# EAGLE design escv1 (EAGLE 9.6.1)
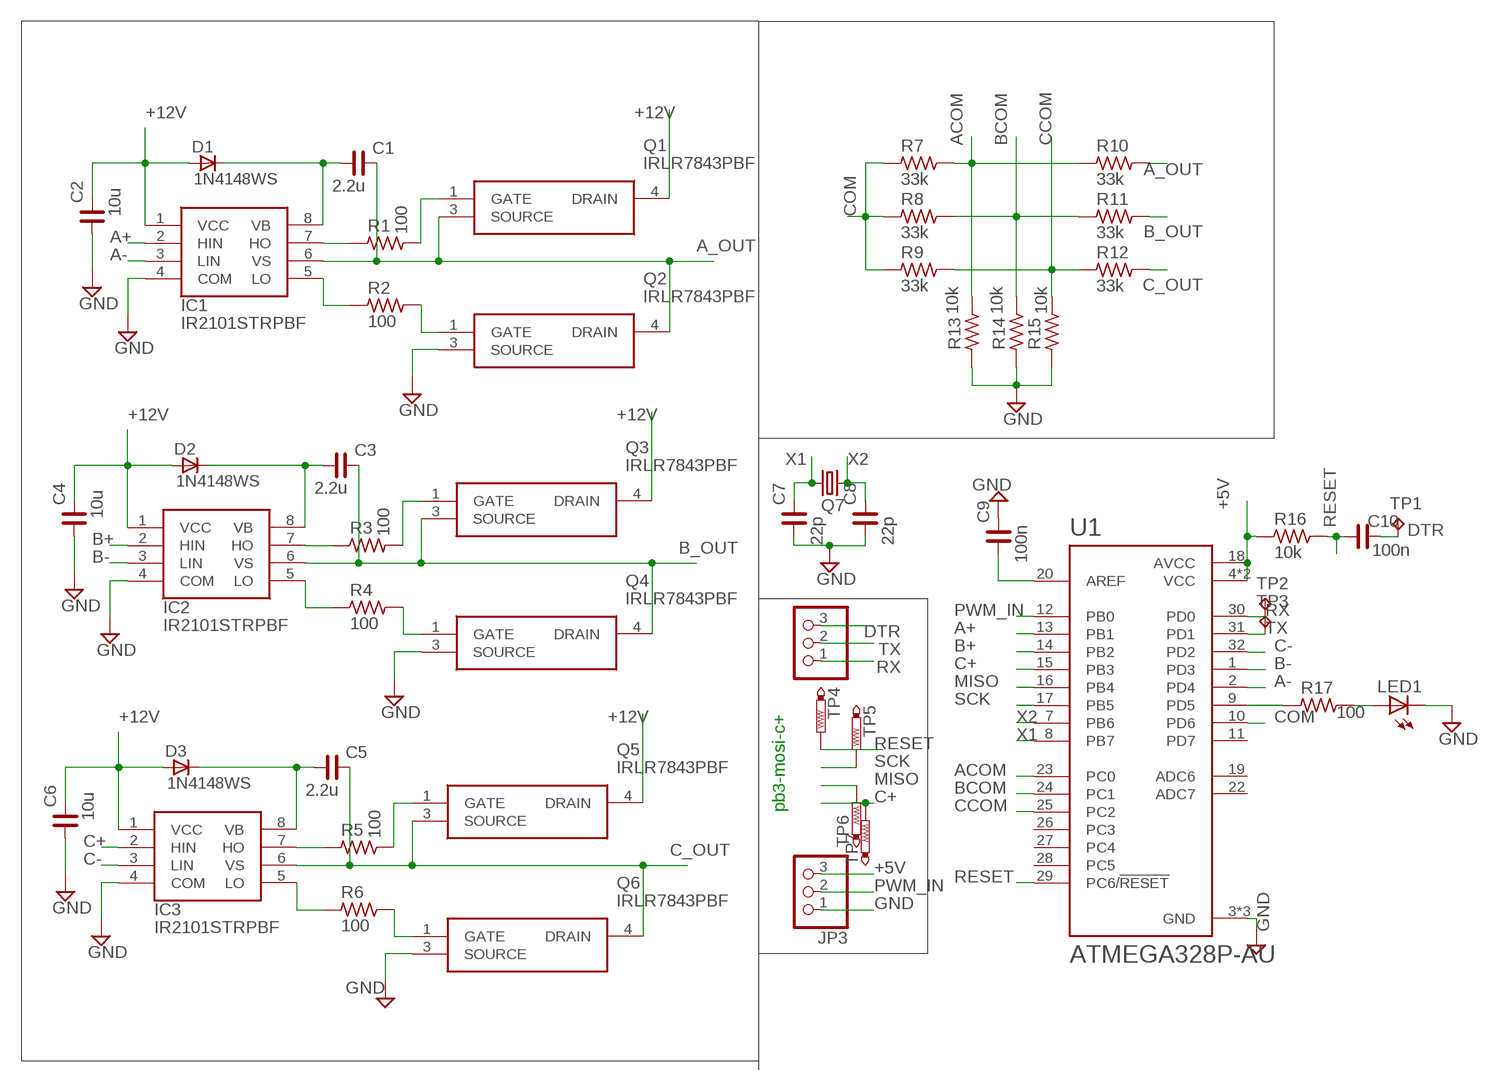
[diagram p0: schematic, sheet 1]

## Parts
C1  2.2u  C_2012  [C2012]
C2  10u  C_2012  [C2012]
C3  2.2u  C_2012  [C2012]
C4  10u  C_2012  [C2012]
C5  2.2u  C_2012  [C2012]
C6  10u  C_2012  [C2012]
C7  22p  C_2012  [C2012]
C8  22p  C_2012  [C2012]
C9  100n  C_2012  [C2012]
C10  100n  C_2012  [C2012]
D1  1N4148WS  [SOD323F]
D2  1N4148WS  [SOD323F]
D3  1N4148WS  [SOD323F]
IC1  IR2101STRPBF  [SOIC127P600X175-8N]
IC2  IR2101STRPBF  [SOIC127P600X175-8N]
IC3  IR2101STRPBF  [SOIC127P600X175-8N]
JP1  PINHD-1X3  [1X03]
JP3  PINHD-1X3  [1X03]
LED1  LEDCHIP-LED0805  [CHIP-LED0805]
Q1  IRLR7843PBF  [D-PAK(TO-252AA)_1]
Q2  IRLR7843PBF  [D-PAK(TO-252AA)_1]
Q3  IRLR7843PBF  [D-PAK(TO-252AA)_1]
Q4  IRLR7843PBF  [D-PAK(TO-252AA)_1]
Q5  IRLR7843PBF  [D-PAK(TO-252AA)_1]
Q6  IRLR7843PBF  [D-PAK(TO-252AA)_1]
Q7  CRYSTALSM49  [SM49]
R1  100  R_2012  [R2012]
R2  100  R_2012  [R2012]
R3  100  R_2012  [R2012]
R4  100  R_2012  [R2012]
R5  100  R_2012  [R2012]
R6  100  R_2012  [R2012]
R7  33k  R_2012  [R2012]
R8  33k  R_2012  [R2012]
R9  33k  R_2012  [R2012]
R10  33k  R_2012  [R2012]
R11  33k  R_2012  [R2012]
R12  33k  R_2012  [R2012]
R13  10k  R_2012  [R2012]
R14  10k  R_2012  [R2012]
R15  10k  R_2012  [R2012]
R16  10k  R_2012  [R2012]
R17  100  R_2012  [R2012]
TP1  TPTP07R  [TP07R]
TP2  TPTP07R  [TP07R]
TP3  TPTP07R  [TP07R]
TP4  PTR1TP10R  [TP10R]
TP5  PTR1TP10R  [TP10R]
TP6  PTR1TP10R  [TP10R]
TP7  PTR1TP10R  [TP10R]
U1  ATMEGA328P-AU  [QFP80P900X900X120-32N]

## Nets
+5V: JP3.3 R16.1 U1.4(VCC) U1.6(VCC) U1.18(AVCC)
+12V: C2.2 C4.2 C6.2 D1.A D2.A D3.A IC1.1(VCC) IC2.1(VCC) IC3.1(VCC) Q1.4(DRAIN) Q3.4(DRAIN) Q5.4(DRAIN)
A+: IC1.2(HIN) U1.13(PB1)
A-: IC1.3(LIN) U1.2(PD4)
A_OUT: C1.2 IC1.6(VS) Q1.3(SOURCE) Q2.4(DRAIN) R10.2
ACOM: R7.2 R10.1 R13.2 U1.23(PC0)
B+: IC2.2(HIN) U1.14(PB2)
B-: IC2.3(LIN) U1.1(PD3)
B_OUT: C3.2 IC2.6(VS) Q3.3(SOURCE) Q4.4(DRAIN) R11.2
BCOM: R8.2 R11.1 R14.2 U1.24(PC1)
C+: IC3.2(HIN) TP7.TP U1.15(PB3)
C-: IC3.3(LIN) U1.32(PD2)
C_OUT: C5.2 IC3.6(VS) Q5.3(SOURCE) Q6.4(DRAIN) R12.2
CCOM: R9.2 R12.1 R15.2 U1.25(PC2)
COM: R7.1 R8.1 R9.1 U1.10(PD6)
DTR: C10.2 JP1.3 TP1.TP
GND: C2.1 C4.1 C6.1 C7.1 C8.1 C9.2 IC1.4(COM) IC2.4(COM) IC3.4(COM) JP3.1 LED1.C Q2.3(SOURCE) Q4.3(SOURCE) Q6.3(SOURCE) R13.1 R14.1 R15.1 U1.3(GND) U1.5(GND) U1.21(GND)
MISO: TP6.TP U1.16(PB4)
N$1: C3.1 D2.C IC2.8(VB)
N$2: C1.1 D1.C IC1.8(VB)
N$3: IC1.7(HO) R1.1
N$4: IC1.5(LO) R2.1
N$5: Q1.1(GATE) R1.2
N$6: Q2.1(GATE) R2.2
N$7: IC2.7(HO) R3.1
N$8: IC2.5(LO) R4.1
N$9: Q3.1(GATE) R3.2
N$10: Q4.1(GATE) R4.2
N$11: C5.1 D3.C IC3.8(VB)
N$12: IC3.7(HO) R5.1
N$13: IC3.5(LO) R6.1
N$14: Q5.1(GATE) R5.2
N$15: Q6.1(GATE) R6.2
N$16: C9.1 U1.20(AREF)
N$17: R17.1 U1.9(PD5)
N$18: LED1.A R17.2
PWM_IN: JP3.2 U1.12(PB0)
RESET: C10.1 R16.2 TP4.TP U1.29(PC6/!RESET)
RX: JP1.1 TP2.TP U1.30(PD0)
SCK: TP5.TP U1.17(PB5)
TX: JP1.2 TP3.TP U1.31(PD1)
X1: C7.2 Q7.1 U1.8(PB7)
X2: C8.2 Q7.2 U1.7(PB6)
Unconnected: U1.11(PD7) U1.19(ADC6) U1.22(ADC7) U1.26(PC3) U1.27(PC4) U1.28(PC5)

## Notes on the sheet
- pb3-mosi-c+

## Library data of the parts
C1-C10 = rc-master-smd:C_: NON-POLARIZED CAP
D1-D3 = _hhn_diodes_smd:1N4148WS: 1N4148 General Purpose Rectifie SMD-Version of 1N4148 Case: SOD 323 F Author: Dipl.-Ing. FH Rainer Bayer HHN Hochschule Heilbronn, rainer.bayer@hs-heilbronn.de Ingenieurbüro ing-rb, mail@ing-rb.de
IC1-IC3 = IR2101STRPBF:IR2101STRPBF: High and Low Side Driver SOIC8 Infineon IR2101STRPBF, Dual MOSFET Power Driver, 360mA, 10 20 V, Non-Inverting, 8-Pin SOIC Source: Datasheet <http://uk.rs-online.com/web/p/products/1248778>; ARROW_PART_NUMBER: IR2101STRPBF; ARROW_PRICE-STOCK: https://www.arrow.com/en/products/ir2101strpbf/infineon-technologies-ag; DESCRIPTION: High and Low Side Driver SOIC8 Infineon IR2101STRPBF, Dual MOSFET Power Driver, 360mA, 10 20 V, Non-Inverting, 8-Pin SOIC; HEIGHT: 1.75mm; MANUFACTURER_NAME: Infineon; MANUFACTURER_PART_NUMBER: IR2101STRPBF; MOUSER_PART_NUMBER: 942-IR2101STRPBF; MOUSER_PRICE-STOCK: https://www.mouser.co.uk/ProductDetail/Infineon-Technologies/IR2101STRPBF?qs=ellYJlE8XiER7yumWzaY8w%3D%3D
JP1 JP3 = pinhead:PINHD-1X3: PIN HEADER
LED1 = adafruit:LED: LED OSRAM: - CHIPLED LG R971, LG N971, LY N971, LG Q971, LY Q971, LO R971, LY R971 LH N974, LH R974 LS Q976, LO Q976, LY Q976 LO Q996 - Hyper CHIPLED LW Q18S LB Q993, LB Q99A, LB R99A - SideLED LS A670, LO A670, LY A670, LG A670, LP A670 LB A673, LV A673, LT A673, LW A673 LH A674 LY A675 LS A676, LA A676, LO A676, LY A676, LW A676 LS A679, LY A679, LG A679 - Hyper Micro SIDELED® LS Y876, LA Y876, LO Y876, LY Y876 LT Y87S - SmartLED LW L88C, LW L88S LB L89C, LB L89S, LG L890 LS L89K, LO L89K, LY L89K LS L896, LA L896, LO L896, LY L896 - TOPLED LS T670, LO T670, LY T670, LG T670, LP T670 LSG T670, LSP T670, LSY T670, LOP T670, LYG T670 LG T671, LOG T671, LSG T671 LB T673, LV T673, LT T673, LW T673 LH T674 LS T676, LA T676, LO T676, LY T676, LB T676, LH T676, LSB T676, LW T676 LB T67C, LV T67C, LT T67C, LS T67K, LO T67K, LY T67K, LW E67C LS E67B, LA E67B, LO E67B, LY E67B, LB E67C, LV E67C, LT E67C LW T67C LS T679, LY T679, LG T679 LS T770, LO T770, LY T770, LG T770, LP T770 LB T773, LV T773, LT T773, LW T773 LH T774 LS E675, LA E675, LY E675, LS T675 LS T776, LA T776, LO T776, LY T776, LB T776 LHGB T686 LT T68C, LB T68C - Hyper Mini TOPLED® LB M676 - Mini TOPLED Santana® LG M470 LS M47K, LO M47K, LY M47K Source: http://www.osram.convergy.de/
Q1-Q6 = IRLR7843PBFtrans:IRLR7843PBF: HEXFET N-Ch MOSFET 161A 30V DPAK Infineon IRLR7843PBF N-channel MOSFET Transistor, 161 A, 30 V, 3-Pin DPAK Source: Datasheet <https://www.infineon.com/dgdl/irlr7843pbf.pdf?fileId=5546d462533600a40153566de53526d8>; ARROW_PART_NUMBER: IRLR7843PBF; ARROW_PRICE-STOCK: https://www.arrow.com/en/products/irlr7843pbf/infineon-technologies-ag; DESCRIPTION: HEXFET N-Ch MOSFET 161A 30V DPAK Infineon IRLR7843PBF N-channel MOSFET Transistor, 161 A, 30 V, 3-Pin DPAK; HEIGHT: mm; MANUFACTURER_NAME: Infineon; MANUFACTURER_PART_NUMBER: IRLR7843PBF; MOUSER_PART_NUMBER: 942-IRLR7843PBF; MOUSER_PRICE-STOCK: https://www.mouser.com/Search/Refine.aspx?Keyword=942-IRLR7843PBF
Q7 = crystal:CRYSTAL: CRYSTAL; OC_FARNELL: unknown; OC_NEWARK: unknown
R1-R17 = rc-master-smd:R_: RESISTOR
TP1-TP3 = testpad:TP: Test pad
TP4-TP7 = testpad:PTR1: TEST PIN
U1 = ATMEGA328P-AU:ATMEGA328P-AU: ATmega Series 20 MHz 32 KB Flash 2 KB SRAM 8-Bit Microcontroller - TQFP-32; AVAILABILITY: Unavailable; DESCRIPTION: AVR AVR® ATmega Microcontroller IC 8-Bit 20MHz 32KB (16K x 16) FLASH 32-TQFP (7x7); DIGIKEY-PURCHASE-URL: https://snapeda.com/shop?store=DigiKey&id=4703996; MF: Microchip Technology; MP: ATMEGA328P-AU; PACKAGE: TQFP-32 Microchip Technology; PRICE: None

## Board
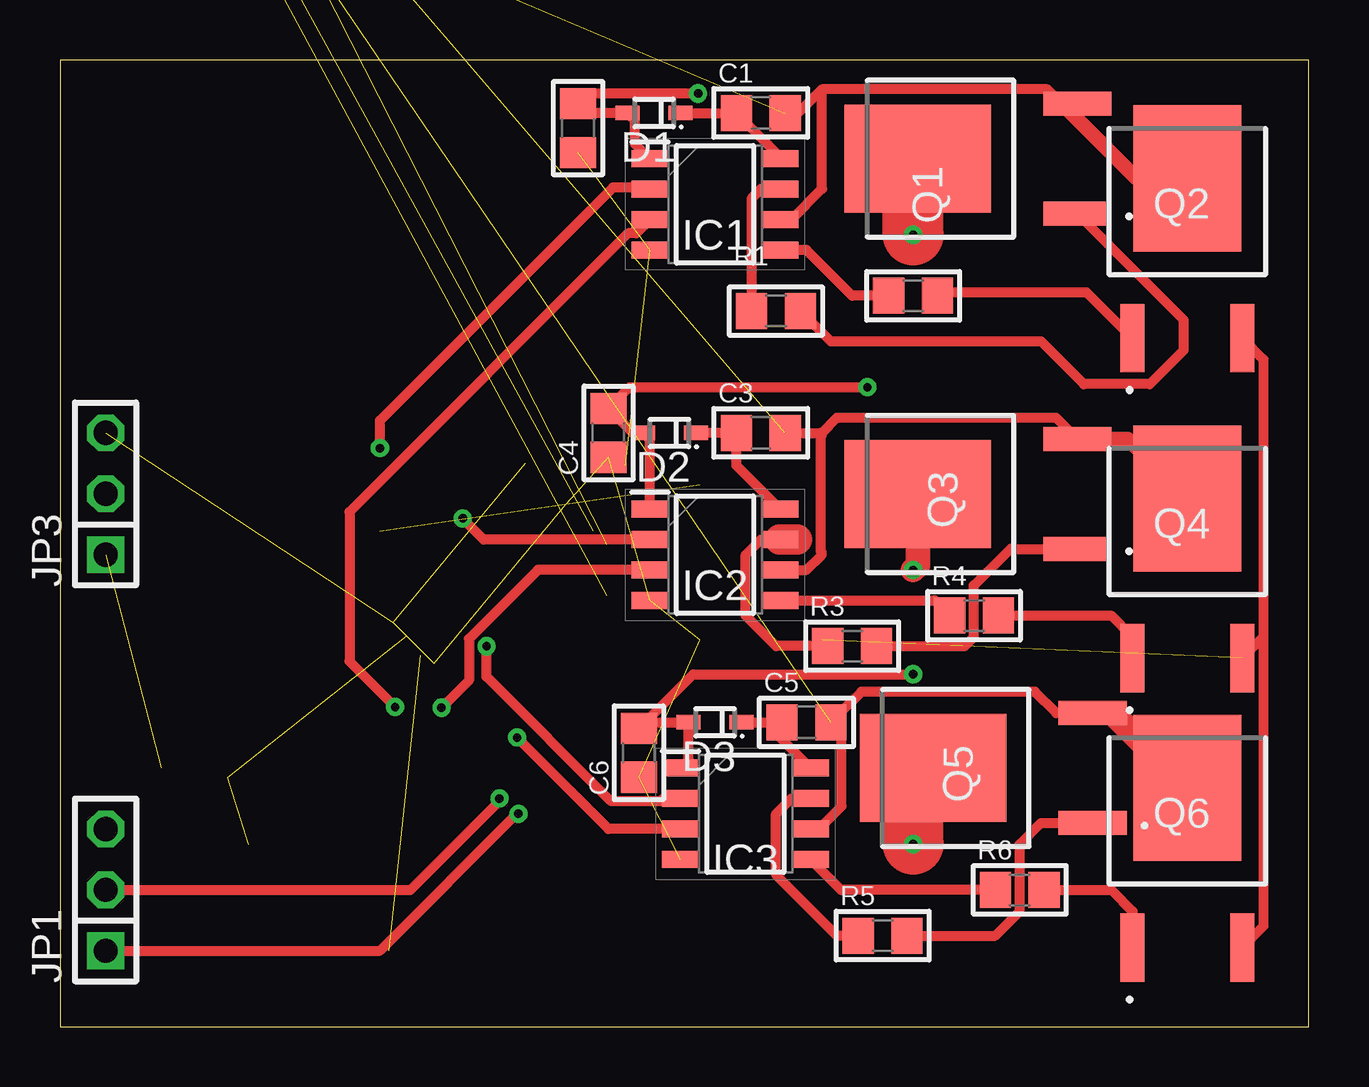
[diagram p1: board, top side]
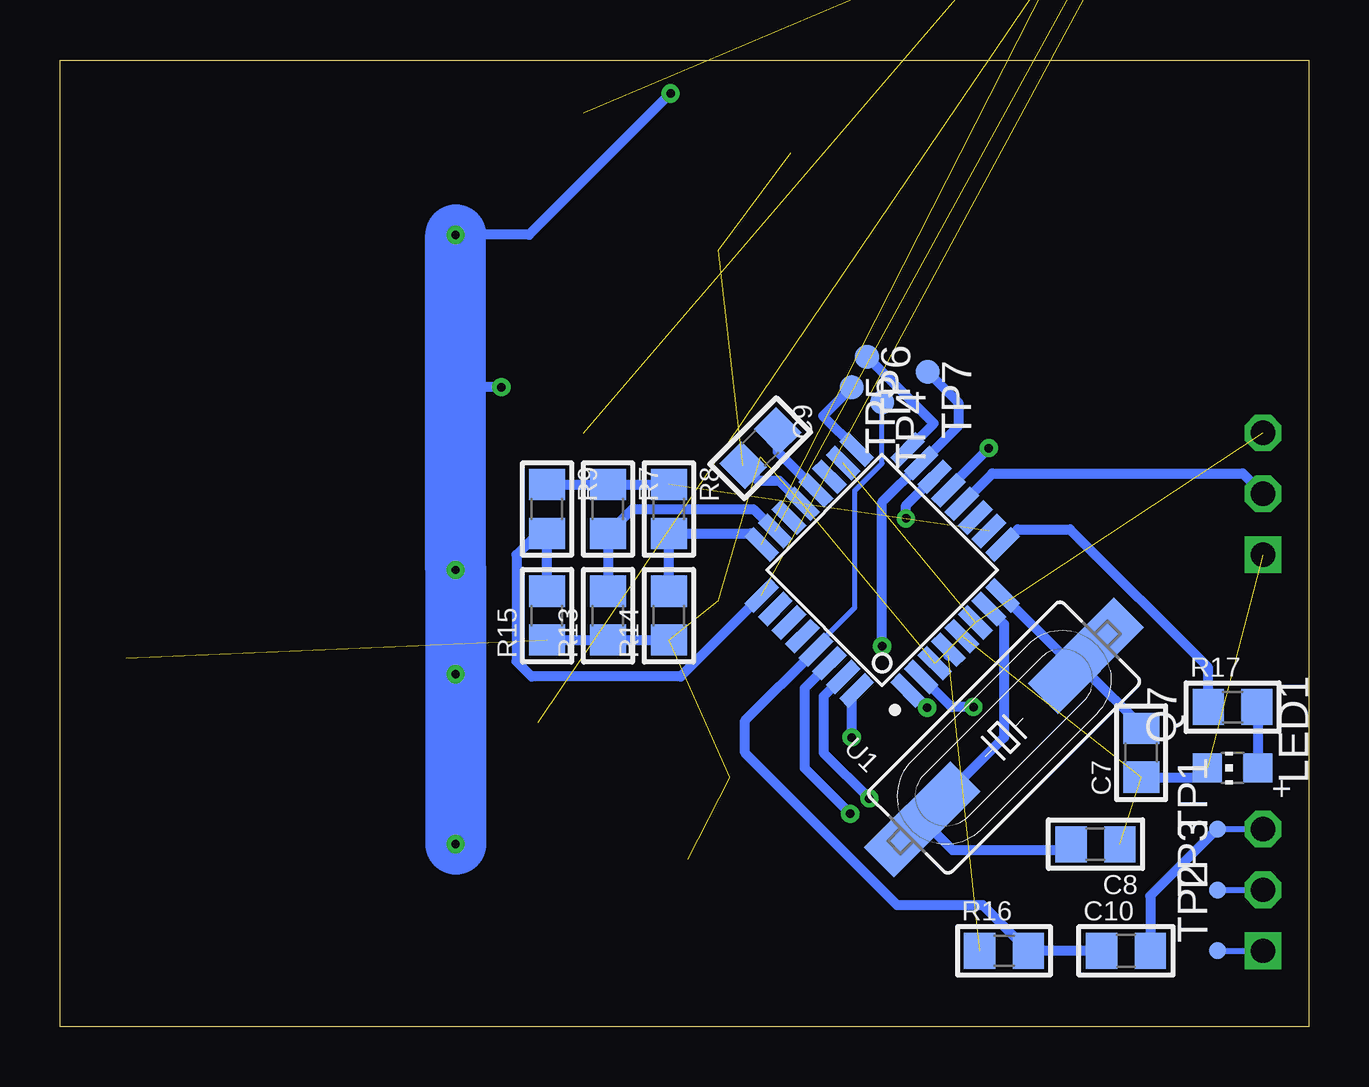
[diagram p2: board, bottom side, seen from below]

Size 52.05 x 40.31 mm. Coordinates in mm from the lower left corner, seen from the top.
Outline: 0,0 52.05,0 52.05,40.31 0,40.31 0,0
Copper layers (1*16): Top 0.035mm / dielectric 1.5mm / Bottom 0.035mm
Design rules "default": minimum track width 6mil, minimum drill 0.35mm, track to track 6mil, track to pad 6mil, pad to pad 6mil, via to via 6mil, smd to smd 6mil, copper to edge 40mil, drill to drill 6mil, minimum pad ring 10mil, minimum via ring 8mil, stop-mask expansion 4mil, vias tented up to drill 0mil, thermal gap 10mil

### Footprints (pad centres in the part's own frame; a part is rotated, then mirrored left to right if it is on the bottom)
C2012 = smd 1.3 x 1.5: 1 -1.016,0; 2 1.016,0
SOD323F = smd 1 x 0.6: A 1.1,0; C -1.1,0
SOIC127P600X175-8N = smd 1.525 x 0.7: 1 -2.712,1.905; 2 -2.712,0.635; 3 -2.712,-0.635; 4 -2.712,-1.905; 5 2.712,-1.905; 6 2.712,-0.635; 7 2.712,0.635; 8 2.712,1.905
1X03 = drill 1.016 square: 1 -2.54,0 | drill 1.016 octagon: 2 0,0; 3 2.54,0
CHIP-LED0805 = smd 1.2 x 1.2: A 0,-1.05; C 0,1.05
D-PAK(TO-252AA)_1 = smd 1 x 2.85: 1 -2.29,-8.75; 3 2.29,-8.75 | smd 4.5 x 6.1: 4 0,-2.1
SM49 = smd 5.08 x 1.778: 1 -4.826,0; 2 4.826,0
R2012 = smd 1.3 x 1.5: 1 -1.016,0; 2 1.016,0
TP07R = smd 0.7 x 0.7: TP 0,0
TP10R = smd 1 x 1: TP 0,0
QFP80P900X900X120-32N = smd 1.5 x 0.55: 1 -4.3,2.8; 2 -4.3,2; 3 -4.3,1.2; 4 -4.3,0.4; 5 -4.3,-0.4; 6 -4.3,-1.2; 7 -4.3,-2; 8 -4.3,-2.8; 17 4.3,-2.8; 18 4.3,-2; 19 4.3,-1.2; 20 4.3,-0.4; 21 4.3,0.4; 22 4.3,1.2; 23 4.3,2; 24 4.3,2.8 | smd 0.55 x 1.5: 9 -2.8,-4.3; 10 -2,-4.3; 11 -1.2,-4.3; 12 -0.4,-4.3; 13 0.4,-4.3; 14 1.2,-4.3; 15 2,-4.3; 16 2.8,-4.3; 25 2.8,4.3; 26 2,4.3; 27 1.2,4.3; 28 0.4,4.3; 29 -0.4,4.3; 30 -1.2,4.3; 31 -2,4.3; 32 -2.8,4.3

### Placement (x,y rotation side)
C1  29.21,38.1 0 top
C2  21.59,37.47 90 top
C3  29.21,24.77 0 top
C4  22.86,24.77 90 top
C5  31.11,12.7 0 top
C6  24.13,11.43 90 top
C7  6.99,11.43 90 bottom
C8  8.89,7.62 180 bottom
C9  22.86,24.13 225 bottom
C10  7.62,3.17 0 bottom
D1  24.77,38.1 180 top
D2  25.4,24.77 180 top
D3  27.3,12.7 180 top
IC1  27.3,34.29 0 top
IC2  27.3,19.68 0 top
IC3  28.57,8.89 0 top
JP1  1.91,5.71 90 top
JP3  1.91,22.22 90 top
LED1  3.17,10.79 90 bottom
Q1  33.66,36.2 90 top
Q2  46.99,37.47 0 top
Q3  33.66,22.22 90 top
Q4  46.99,24.13 0 top
Q5  34.29,10.79 90 top
Q6  46.99,12.06 0 top
Q7  12.7,12.06 225 bottom
R1  29.84,29.84 0 top
R2  35.56,30.48 0 top
R3  33.02,15.88 0 top
R4  38.1,17.14 0 top
R5  34.29,3.81 0 top
R6  40.01,5.71 0 top
R7  29.21,21.59 270 bottom
R8  26.67,21.59 270 bottom
R9  31.75,21.59 270 bottom
R10  5.71,48.9 180 top  (outside the outline)
R11  10.16,46.99 0 top  (outside the outline)
R12  9.53,44.45 0 top  (outside the outline)
R13  29.21,17.14 90 bottom
R14  26.67,17.14 90 bottom
R15  31.75,17.14 90 bottom
R16  12.7,3.17 0 bottom
R17  3.17,13.33 0 bottom
TP1  3.81,8.26 90 bottom
TP2  3.81,3.17 90 bottom
TP3  3.81,5.71 90 bottom
TP4  17.78,26.04 270 bottom
TP5  19.05,26.67 270 bottom
TP6  18.41,27.94 270 bottom
TP7  15.88,27.3 270 bottom
U1  17.78,19.05 135 bottom

### Tracks (layer width: path | path; a pad name or v marks a point on that pad's centre or on a via)
+5V  (4 unrouted)
  Bottom 0.406: 15.02,15.49 U1.4
+12V  (via drill 0.35)
  Top 0.406: IC1.1 23.96,36.83 23.96,37.81 D1.A 21.97,38.1 C2.2 22.02,38.92 v26.6,38.92 | IC2.1 24.59,24.47 D2.A 23.88,24.77 C4.2 23.75,26.67 v33.66,26.67 | IC3.1 26.2,11.14 D3.A 24.38,12.7 C6.2 26.39,14.7 v35.56,14.7 | 35.56,9.96 Q5.4
  Top 0.61: 36.22,36.66 Q1.4 | C4.2 22.94,25.86
  Top 1.016: v35.56,19.05 35.76,19.25 Q3.4
  Top 2.54: v35.56,7.62 35.56,9.96 | v35.56,33.02 35.56,36 Q1.4
  Bottom 0.406: v33.66,26.67 35.56,26.67 | v26.6,38.92 32.49,33.02 v35.56,33.02
  Bottom 2.54: v35.56,7.62 v35.56,14.7 v35.56,19.05 35.56,26.67 v35.56,33.02
A+  (via drill 0.35)
  Top 0.406: IC1.2 24.52,35 23.05,35 13.34,25.28 v13.34,24.13
  Bottom 0.406: v13.34,24.13 15.02,22.44 U1.13
A-  (via drill 0.35)
  Top 0.406: IC1.3 24.03,33.09 23.68,33.09 12.06,21.47 12.06,15.24 v13.97,13.33
  Bottom 0.406: U1.2 14.89,13.33 v13.97,13.33
A_OUT  (1 unrouted)
  Top 0.406: 42.03,38.22 41.16,39.09 31.75,39.09 | IC1.6 30.48,33.66 31.77,34.95 31.77,39.07 31.75,39.09 | C1.2 30.76,38.1 31.75,39.09
  Top 0.61: Q2.4 44.89,35.37 42.03,38.22 42.14,38.22 Q1.3
ACOM  (1 unrouted)
  Bottom 0.406: R7.2 29.46,20.57 | R7.2 29.21,20.95 | U1.23 23.15,21.59 28.19,21.59 R7.2 | R7.2 R13.2
B+  (via drill 0.35)
  Top 0.406: IC2.2 17.67,20.32 v16.78,21.2
  Bottom 0.406: U1.14 16.78,21.74 v16.78,21.2
B-  (via drill 0.35)
  Top 0.406: v15.9,13.31 17.05,14.45 17.05,16.18 19.92,19.05 IC2.3
  Bottom 0.406: v15.9,13.31 16.63,14.03 U1.1
B_OUT  (1 unrouted)
  Top 0.406: IC2.6 31.11,19.05 31.75,19.68 31.75,19.79 31.71,19.83 31.71,24.13 31.71,24.62 | 31.71,24.62 31.71,24.77 C3.2 | 31.71,24.62 31.75,24.66 31.75,24.77 32.38,25.4 41.52,25.4 Q3.3
  Top 0.61: Q4.4 44.51,24.52 Q3.3
BCOM  (1 unrouted)
  Bottom 0.406: 26.42,18.16 R14.2 R8.2 23.26,20.57 U1.24
C+  (via drill 0.35)
  Top 0.406: IC3.2 25.14,9.53 25.03,9.41 22.98,9.41 17.78,14.61 v17.78,15.88
  Bottom 0.406: TP7.TP 14.61,26.04 14.61,25.05 U1.15 17.78,21.88 v17.78,15.88
C-  (via drill 0.35)
  Top 0.406: IC3.3 22.86,8.26 v19.05,12.06
  Bottom 0.406: U1.32 19.05,13.82 v19.05,12.06
C_OUT  (1 unrouted)
  Top 0.406: Q5.3 41.52,13.08 40.64,13.97 33.4,13.97 32.58,13.14 | 32.58,13.14 C5.2 | IC3.6 31.36,8.18 31.56,8.18 32.58,9.2 32.58,13.14
  Top 1.016: Q6.4 43.87,13.08 Q5.3
CCOM  (1 unrouted)
  Bottom 0.406: R15.2 R9.2 31.75,20.95 33.02,19.68 33.02,15.24 32.38,14.61 26.18,14.61 U1.25
COM  (1 unrouted)
  Bottom 0.406: R9.1 R7.1 R8.1
DTR
  Bottom 0.254: TP1.TP JP1.3
  Bottom 0.406: TP1.TP 6.6,5.46 C10.2
GND  (13 unrouted)
  Top 0.406: Q2.3 50.16,27.83 50.16,16.27 | 50.16,16.27 Q4.3 | 50.16,16.27 50.16,4.2 Q6.3
  Bottom 0.406: C9.2 22.94,22.78 22.07,22.78 U1.21 | C7.1 4.61,10.41 LED1.C | R15.1 R13.1 R14.1
MISO
  Bottom 0.406: U1.16 15.63,25.16 TP6.TP
N$1
  Top 0.406: D2.C C3.1 28.19,23.41 IC2.8
N$2
  Top 0.406: IC1.8 30.02,36.28 C1.1 D1.C
N$3
  Top 0.406: IC1.7 29.21,34.93 28.83,34.54 R1.1
N$4
  Top 0.406: R2.1 33.02,30.48 31.11,32.38 IC1.5
N$5
  Top 0.406: R1.2 32.13,28.57 40.9,28.57 42.67,26.8 45.42,26.8 46.83,28.2 46.83,29.48 Q1.1
N$6
  Top 0.406: R2.2 36.72,30.62 42.8,30.62 Q2.1
N$7
  Top 0.406: R3.1 29.84,15.88 28.57,17.14 28.57,19.68 29.21,20.32 IC2.7
  Top 1.27: IC2.7 30.72,20.32
N$8
  Top 0.406: IC2.5 36.45,17.78 R4.1
N$9
  Top 0.406: R3.2 37.72,15.88 38.09,16.25 38.09,18.41 39.62,19.93 Q3.1
N$10
  Top 0.406: R4.2 43.81,17.14 44.7,16.26 Q4.1
N$11
  Top 0.406: D3.C 29.84,12.7 | 29.84,12.7 C5.1 | IC3.8 29.84,12.24 29.84,12.7
N$12
  Top 0.406: R5.1 32.38,3.81 29.84,6.35 29.84,8.89 30.48,9.53 IC3.7
N$13
  Top 0.406: R6.1 32.56,5.71 IC3.5
N$14
  Top 0.406: Q5.1 41.91,8.51 41.77,8.51 40.89,8.51 40.01,7.62 40.01,4.83 38.99,3.81 R5.2
N$15
  Top 0.406: R6.2 43.81,5.71 44.7,4.83 Q6.1
N$16
  Bottom 0.406: C9.1 22.14,23.98 U1.20
N$17
  Bottom 0.406: U1.9 12.12,20.75 9.95,20.75 4.19,14.99 R17.1
N$18
  Bottom 0.406: R17.2 2.12,13.3 LED1.A
PWM_IN
  Bottom 0.406: U1.12 13.19,23.08 2.76,23.08 JP3.2
RESET
  Bottom 0.203: TP4.TP 17.78,23.5 18.93,22.34 18.93,17.47 20.61,15.79 U1.29
  Bottom 0.406: C10.1 R16.2 13.59,5.08 17.14,5.08 23.5,11.43 23.5,12.77 U1.29
RX  (via drill 0.35)
  Top 0.406: JP1.1 13.34,3.17 19.08,8.92 v19.11,8.89
  Bottom 0.254: TP2.TP JP1.1
  Bottom 0.406: v19.11,8.89 21.02,10.79 21.02,14.12 U1.30
SCK
  Bottom 0.406: U1.17 20.25,25.47 TP5.TP
TX  (via drill 0.35)
  Top 0.406: JP1.2 14.61,5.71 18.32,9.43 v18.32,9.53
  Bottom 0.254: TP3.TP JP1.2
  Bottom 0.406: U1.31 20.22,13.78 20.22,11.43 v18.32,9.53
X1
  Bottom 0.406: U1.8 10.25,15.48 Q7.1 9.29,14.84 6.99,12.54 C7.2
X2
  Bottom 0.406: C8.2 10.14,7.38 14.84,7.38 Q7.2 12.7,12.06 12.7,16.8 U1.7